# Altium schematic sheet PortSwitcherFPGA1C_Evalboard.SchDoc: LiveDesign Evaluation - Port Switcher
size B; Organization: Altium Limited; Address1: L3, 12a Rodborough Rd; Address2: Frenchs Forest; Address3: NSW; Address4: Australia 2086; DocumentNumber: 1; SheetNumber: 1; SheetTotal: 5
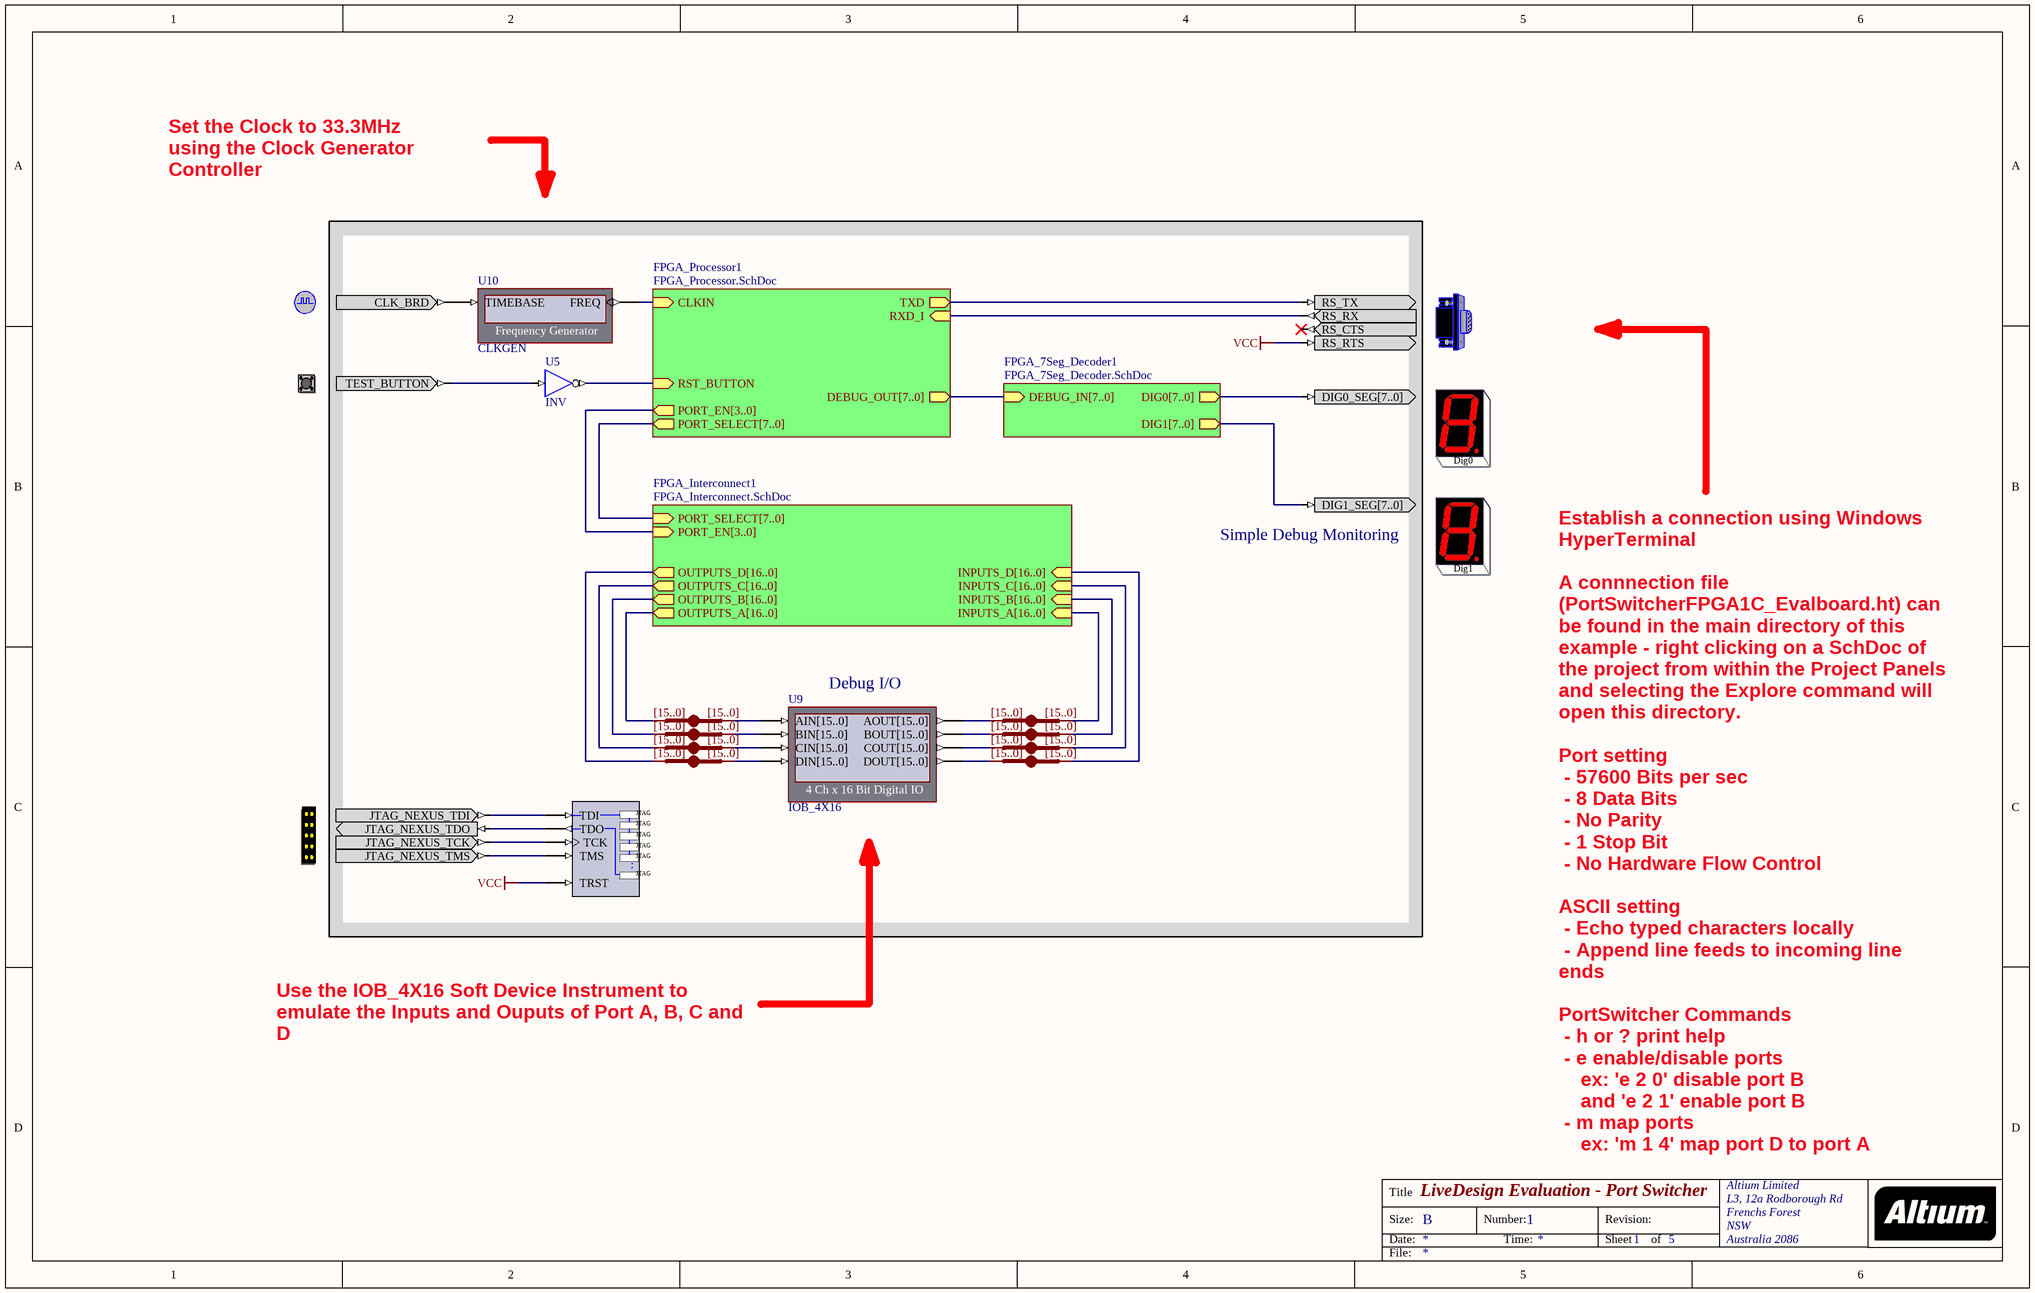
[diagram p0: PortSwitcherFPGA1C_Evalboard.SchDoc]

## Parts
7SEG0  7SEG0  (value not drawn)
7SEG1  7SEG1  (value not drawn)
CLOCK_BOARD  CLOCK_BOARD  (value not drawn)
JB_S2  IndexA: [15..0]  (hidden comment: JB)
JB_S3  IndexA: [15..0]  (hidden comment: JB)
JB_S4  IndexA: [15..0]  (hidden comment: JB)
JB_S5  IndexA: [15..0]  (hidden comment: JB)
JB_S6  IndexA: [15..0]  (hidden comment: JB)
JB_S7  IndexA: [15..0]  (hidden comment: JB)
JB_S8  IndexA: [15..0]  (hidden comment: JB)
JB_S9  IndexA: [15..0]  (hidden comment: JB)
NEXUS_JTAG_CONNECTOR  NEXUS_JTAG_CONNECTOR  (value not drawn)
NEXUS_JTAG_PORT  NEXUS_JTAG_PORT  (value not drawn)
RS232CNTR  RS232CNTR  (value not drawn)
TEST_BUTTON  TEST_BUTTON  (value not drawn)
U5  INV
U9  IOB_4X16
U10  CLKGEN

## Sub-sheets
FPGA_7Seg_Decoder1 = FPGA_7Seg_Decoder.SchDoc: DEBUG_IN[7..0] (in), DIG0[7..0] (out), DIG1[7..0] (out)
FPGA_Interconnect1 = FPGA_Interconnect.SchDoc: PORT_SELECT[7..0] (in), OUTPUTS_D[16..0] (out), OUTPUTS_C[16..0] (out), OUTPUTS_B[16..0] (out), OUTPUTS_A[16..0] (out), PORT_EN[3..0] (in), INPUTS_A[16..0] (in), INPUTS_B[16..0] (in), INPUTS_C[16..0] (in), INPUTS_D[16..0] (in)
FPGA_Processor1 = FPGA_Processor.SchDoc: TXD (out), RXD_I (in), CLKIN (in), RST_BUTTON (in), PORT_SELECT[7..0] (out), PORT_EN[3..0] (out), DEBUG_OUT[7..0] (out)

## Nets
VCC: NEXUS_JTAG_PORT.TRST RS232CNTR.RS_RTS
Net7SEG0_DIG0_SEG[7..0]: 7SEG0.DIG0_SEG[7..0] ; sheet FPGA_7Seg_Decoder1/DIG0[7..0]
Net7SEG1_DIG1_SEG[7..0]: 7SEG1.DIG1_SEG[7..0] ; sheet FPGA_7Seg_Decoder1/DIG1[7..0]
NetCLOCK_BOARD_CLK_BRD: CLOCK_BOARD.CLK_BRD U10.TIMEBASE
NetJB_S2_A[0..0]: JB_S2.A[0..0] ; sheet FPGA_Interconnect1/OUTPUTS_A[16..0]
NetJB_S2_B[0..0]: JB_S2.B[0..0] U9.AIN[15..0]
NetJB_S3_A[0..0]: JB_S3.A[0..0] U9.AOUT[15..0]
NetJB_S3_B[0..0]: JB_S3.B[0..0] ; sheet FPGA_Interconnect1/INPUTS_A[16..0]
NetJB_S4_A[0..0]: JB_S4.A[0..0] ; sheet FPGA_Interconnect1/OUTPUTS_B[16..0]
NetJB_S4_B[0..0]: JB_S4.B[0..0] U9.BIN[15..0]
NetJB_S5_A[0..0]: JB_S5.A[0..0] U9.BOUT[15..0]
NetJB_S5_B[0..0]: JB_S5.B[0..0] ; sheet FPGA_Interconnect1/INPUTS_B[16..0]
NetJB_S6_A[0..0]: JB_S6.A[0..0] ; sheet FPGA_Interconnect1/OUTPUTS_C[16..0]
NetJB_S6_B[0..0]: JB_S6.B[0..0] U9.CIN[15..0]
NetJB_S7_A[0..0]: JB_S7.A[0..0] U9.COUT[15..0]
NetJB_S7_B[0..0]: JB_S7.B[0..0] ; sheet FPGA_Interconnect1/INPUTS_C[16..0]
NetJB_S8_A[0..0]: JB_S8.A[0..0] ; sheet FPGA_Interconnect1/OUTPUTS_D[16..0]
NetJB_S8_B[0..0]: JB_S8.B[0..0] U9.DIN[15..0]
NetJB_S9_A[0..0]: JB_S9.A[0..0] U9.DOUT[15..0]
NetJB_S9_B[0..0]: JB_S9.B[0..0] ; sheet FPGA_Interconnect1/INPUTS_D[16..0]
NetNEXUS_JTAG_CONNECTOR_JTAG_NEXUS_TCK: NEXUS_JTAG_CONNECTOR.JTAG_NEXUS_TCK NEXUS_JTAG_PORT.TCK
NetNEXUS_JTAG_CONNECTOR_JTAG_NEXUS_TDI: NEXUS_JTAG_CONNECTOR.JTAG_NEXUS_TDI NEXUS_JTAG_PORT.TDI
NetNEXUS_JTAG_CONNECTOR_JTAG_NEXUS_TDO: NEXUS_JTAG_CONNECTOR.JTAG_NEXUS_TDO NEXUS_JTAG_PORT.TDO
NetNEXUS_JTAG_CONNECTOR_JTAG_NEXUS_TMS: NEXUS_JTAG_CONNECTOR.JTAG_NEXUS_TMS NEXUS_JTAG_PORT.TMS
NetRS232CNTR_RS_RX: RS232CNTR.RS_RX ; sheet FPGA_Processor1/RXD_I
NetRS232CNTR_RS_TX: RS232CNTR.RS_TX ; sheet FPGA_Processor1/TXD
NetTEST_BUTTON_TEST_BUTTON: TEST_BUTTON.TEST_BUTTON U5.I
NetU5_O: U5.O ; sheet FPGA_Processor1/RST_BUTTON
NetU10_FREQ: U10.FREQ ; sheet FPGA_Processor1/CLKIN

Not connected (* = marked no-connect by the designer): RS232CNTR RS_CTS*

## Buses and harness runs
bus sheet FPGA_7Seg_Decoder1/DEBUG_IN[7..0] = sheet FPGA_Processor1/DEBUG_OUT[7..0]
bus sheet FPGA_Interconnect1/PORT_EN[3..0] = sheet FPGA_Processor1/PORT_EN[3..0]
bus sheet FPGA_Interconnect1/PORT_SELECT[7..0] = sheet FPGA_Processor1/PORT_SELECT[7..0]

## Notes on the sheet
- Set the Clock to 33.3MHz using the Clock Generator Controller
- (near 7SEG1) Simple Debug Monitoring
- (near U9) Debug I/O
- Use the IOB_4X16 Soft Device Instrument to emulate the Inputs and Ouputs of Port A, B, C and D
- Establish a connection using Windows HyperTerminal
  A connnection file (PortSwitcherFPGA1C_Evalboard.ht) can be found in the main directory of this example - right clicking on a SchDoc of the project from within the Project Panels and selecting the Explore command will open this directory.
  Port setting
  - 57600 Bits per sec
  - 8 Data Bits
  - No Parity
  - 1 Stop Bit
  - No Hardware Flow Control
  ASCII setting
  - Echo typed characters locally
  - Append line feeds to incoming line ends
  PortSwitcher Commands
  - h or ? print help
  - e enable/disable ports
  ex: 'e 2 0' disable port B
  and 'e 2 1' enable port B
  - m map ports
  ex: 'm 1 4' map port D to port A
  and 'm 4 1' map port A to port D
- Title
- Size:
- Date:
- B
- Number:
- Time:
- Revision:
- Sheet
- of
- File:
- (in symbol 7SEG0) Dig0
- (in symbol 7SEG1) Dig1
- (in symbol NEXUS_JTAG_PORT) JTAG; .

## Library data of the parts
7SEG0 = 7SEG0: 7 Segment display module; PortComponent: True; Publisher: Altium Limited; Published: 9-Sept-2004
7SEG1 = 7SEG1: 7 Segment display module; PortComponent: True; Publisher: Altium Limited; Published: 9-Sept-2004
CLOCK_BOARD = CLOCK_BOARD: Global System Clock Supply; PortComponent: True; Published: 19-Nov-2003; Publisher: Altium Limited
JB_S2-JB_S9 = JB: System BUS Joiner; Published: 29-Jan-2004; Publisher: Altium Limited; Core Revision: 1.00.00; IndexB: [15..0]
NEXUS_JTAG_CONNECTOR = NEXUS_JTAG_CONNECTOR: JTAG Port; PortComponent: True; Published: 19-Nov-2003; Publisher: Altium Limited
NEXUS_JTAG_PORT = NEXUS_JTAG_PORT: Soft Nexus-Chain Connector; NEXUS_JTAG_CONNECTOR: True; Published: 18-Dec-2003; Publisher: Altium Limited
RS232CNTR = RS232CNTR: DCE Serial Port Connector; PortComponent: True; Published: 19-Nov-2003; Publisher: Altium Limited
TEST_BUTTON = TEST_BUTTON: Test Button; PortComponent: True; Published: 19-Nov-2003; Publisher: Altium Limited
U5 = INV: Inverter; ArchiveName: GENERIC; VHDLIB_SIM: GENERIC_LIB; Published: 29-Jan-2004; Publisher: Altium Limited; Xilinx Equivalent: INV; Core Revision: 1.00.00
U9 = IOB_4X16: 4 Ch x 16 Bit Digital IO; NEXUS_CORE: Instrument; NEXUS_JTAG_DEVICE: True; NEXUS_JTAG_ORDER: 0; Published: 30/09/2003; Publisher: Altium Hobart Technology Centre; Core Revision: 1.00.00
U10 = CLKGEN: Frequency Generator; NEXUS_CORE: Instrument; NEXUS_JTAG_DEVICE: True; NEXUS_JTAG_ORDER: 0; Published: 18/12/2003; Publisher: Altium Hobart Technology Centre; Core Revision: 1.00.00